# Altium project BlockDetectorHall.PrjPcb
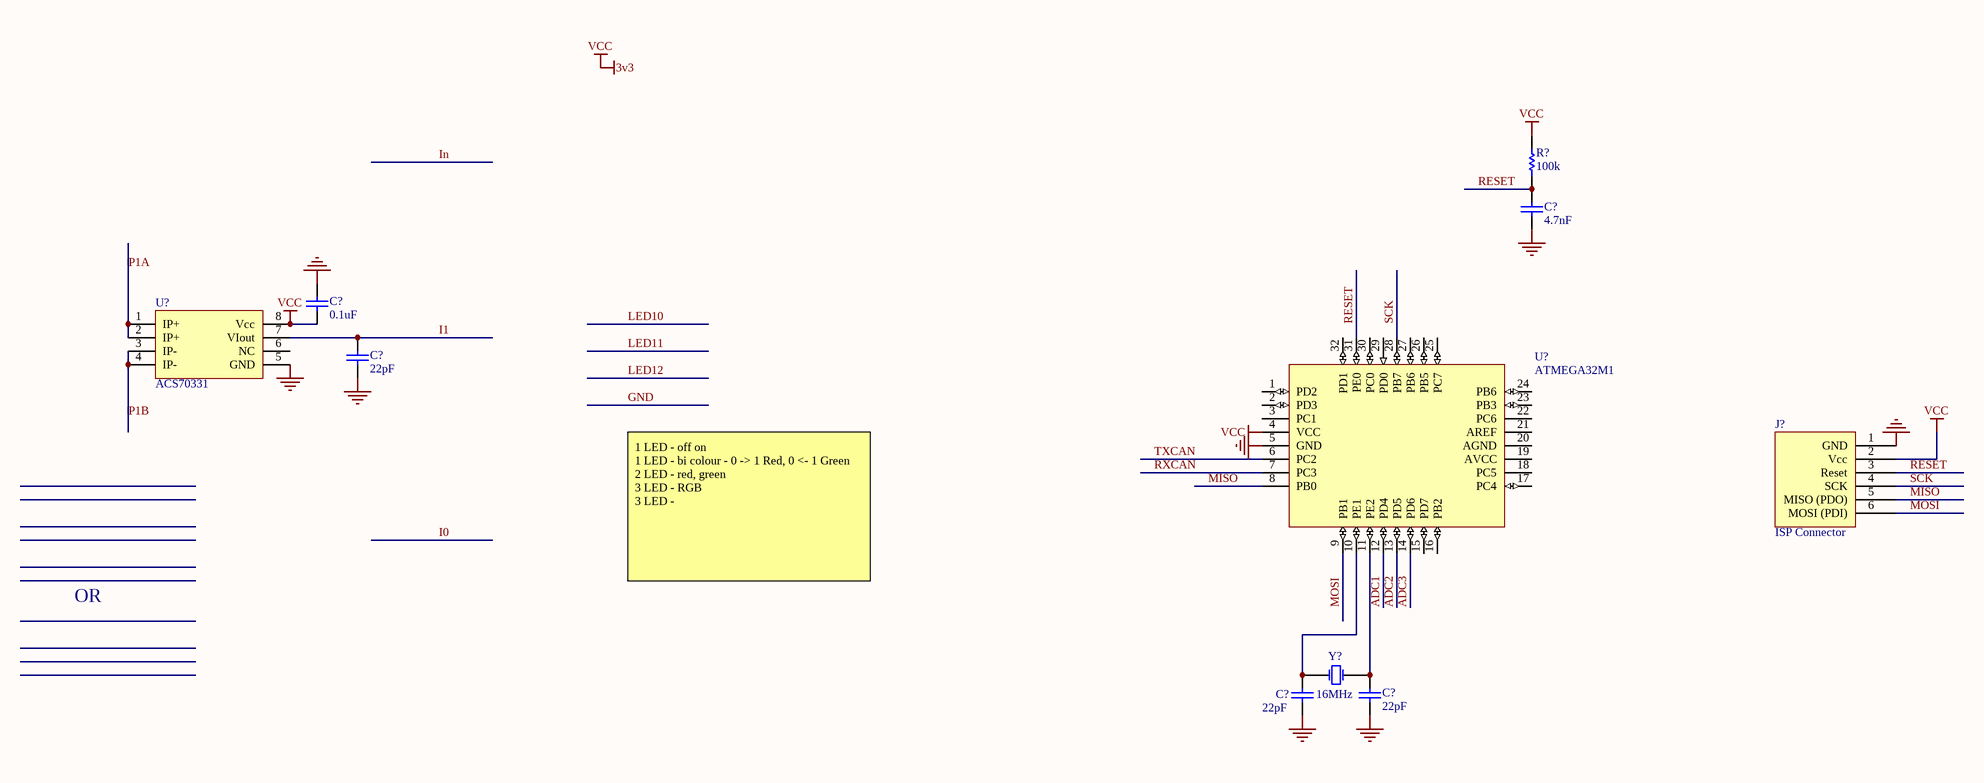
[diagram p0: BlockDetectorHall.SchDoc]
1 sheet, 10 parts. Net scope: global (net labels, ports and power ports of the same name join across sheets).

## Sheet BlockDetectorHall.SchDoc
size A0

### Parts
(Parts that share a designator on the sheet are numbered #1, #2 ... from top to bottom, then left to right.)
C?#1  value 4.7nF  [Cap SMD 0805A]  (hidden comment: Cap)
C?#2  value 0.1uF  [Cap SMD 0805A]  (hidden comment: Cap)
C?#3  value 22pF  [Cap SMD 0805A]  (hidden comment: Cap)
C?#4  value 22pF  [Cap SMD 0805A]  (hidden comment: Cap)
C?#5  value 22pF  [Cap SMD 0805A]  (hidden comment: Cap)
J?  ISP Connector  [HDR2x3]
R?  value 100k  [Res SMD 0805A]  (hidden comment: Res1)
U?#1  ACS70331  [SOIC8]
U?#2  ATMEGA32M1  [TQFP32]
Y?  16MHz  [R38]

### Nets
3v3: C?#2.2 J?.2(Vcc) R?.2 U?#1.8(Vcc) U?#2.4(VCC)  [also labelled VCC]
GND: C?#1.2 C?#2.1 C?#3.1 C?#4.1 C?#5.1 J?.1(GND) U?#1.5(GND) U?#2.5(GND)
ADC1: U?#2.12(PD4)
ADC2: U?#2.13(PD5)
ADC3: U?#2.14(PD6)
I1: C?#3.2 U?#1.7(VIout)
MISO: J?.5(MISO_(PDO)) U?#2.8(PB0)
MOSI: J?.6(MOSI_(PDI)) U?#2.9(PB1)
P1A: U?#1.1(IP+) U?#1.2(IP+)
P1B: U?#1.3(IP-) U?#1.4(IP-)
RESET: C?#1.1 J?.3(Reset) R?.1 U?#2.31(PE0)
RXCAN: U?#2.7(PC3)
SCK: J?.4(SCK) U?#2.28(PB7)
TXCAN: U?#2.6(PC2)
NetC?#4_2: C?#4.2 U?#2.10(PE1) Y?.1(OSC1)
NetC?#5_2: C?#5.2 U?#2.11(PE2) Y?.2(OSC2)

Not connected (* = marked no-connect by the designer): U?#1 6(NC); U?#2 1(PD2) 2(PD3) 3(PC1) 15(PD7) 16(PB2) 17(PC4) 18(PC5) 19(AVCC) 20(AGND) 21(AREF) 22(PC6) 23(PB3) 24(PB6) 25(PC7) 26(PB5) 27(PB6) 29(PD0) 30(PC0) 32(PD1)

### Notes on the sheet
- OR
- 1 LED - off on
  1 LED - bi colour - 0 -> 1 Red, 0 <- 1 Green
  2 LED - red, green
  3 LED - RGB
  3 LED -

### Library data of the parts
C?#1-C?#5 = Cap: Capacitor; Published: 8-Jun-2000; LatestRevisionDate: 17-Jul-2002; LatestRevisionNote: Re-released for DXP Platform.; PackageReference: RAD-0.3; Publisher: Altium Limited; PackageDescription: Radial Cap, Thru-Hole; 2 Leads; 0.3 in Pin Spacing
J? = ISP Connector: pin to pad: 1>6 3>5 4>3 5>1 6>4
R? = Resistor
U?#1 = ACS70331: Hall Current Sensor
U?#2 = ATMEGA64M1: 8-Bit AVR Microcontroller; Package Information: Latest Revision: revB, Oct-2001; Code - JEDEC: MS-026-ABA; Published: 17-Sep-2003; Datasheet: Latest Revision: 1042G-AVR-09/02; Package Reference: 32A; Publisher: Altium Limited
Y? = XTAL: Crystal Oscillator; Published: 8-Jun-2000; LatestRevisionDate: 17-Jul-2002; LatestRevisionNote: Re-released for DXP Platform.; PackageReference: R38; Publisher: Altium Limited; PackageDescription: Crystal, Thru-Hole; 2 Leads; Body 3.1 x 8.2 mm (Dia.xH)